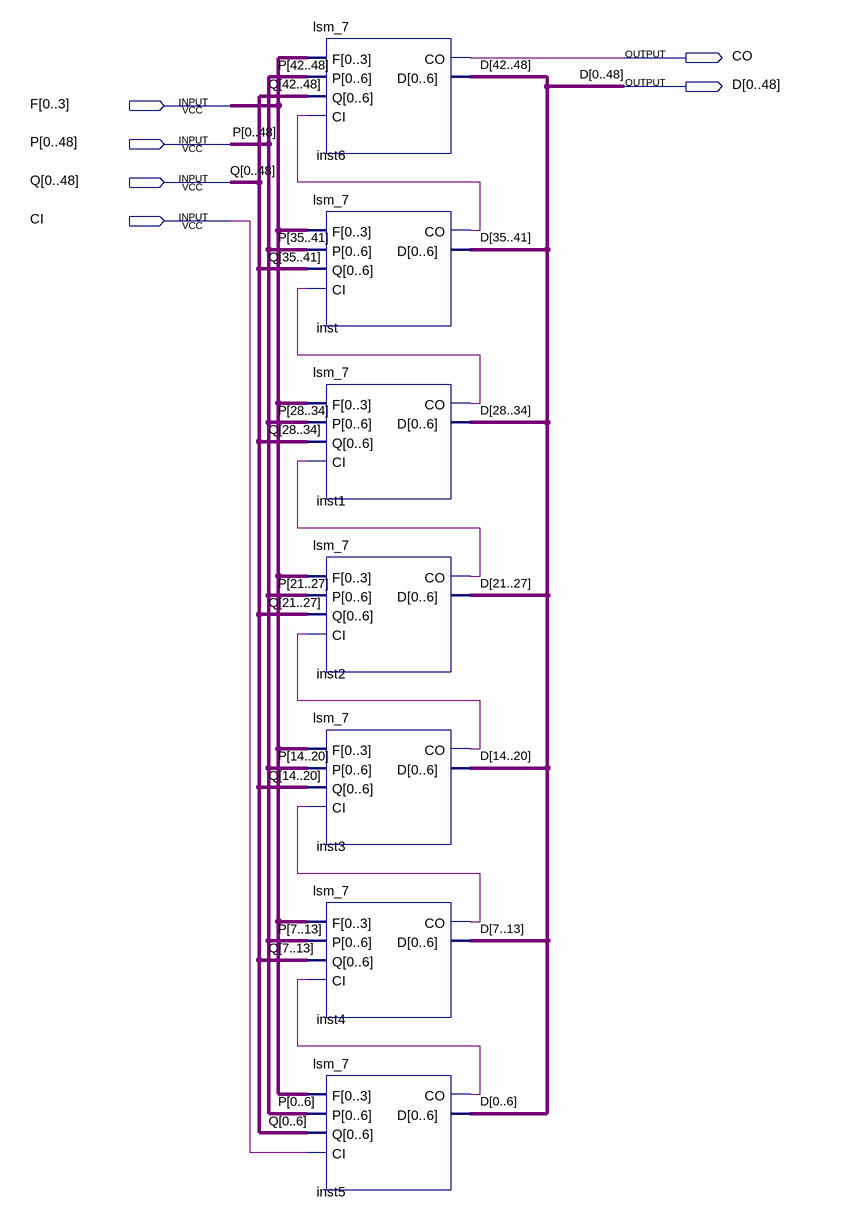
[diagram p0: schematic sheet]
// Quartus schematic lsm.bdf as structural Verilog: 7 symbols, 6 pins
module lsm (
  input  [0:3] F,
  input  [0:48] P,
  input  [0:48] Q,
  input  CI,
  output CO,
  output [0:48] D
);

  wire inst1_co, inst2_co, inst3_co, inst4_co, inst5_co, inst_co;

  lsm_7 inst6 (.F(F), .P(P[42:48]), .Q(Q[42:48]), .CI(inst_co), .CO(CO), .D(D[42:48]));
  lsm_7 inst (.F(F), .P(P[35:41]), .Q(Q[35:41]), .CI(inst1_co), .CO(inst_co), .D(D[35:41]));
  lsm_7 inst1 (.F(F), .P(P[28:34]), .Q(Q[28:34]), .CI(inst2_co), .CO(inst1_co), .D(D[28:34]));
  lsm_7 inst2 (.F(F), .P(P[21:27]), .Q(Q[21:27]), .CI(inst3_co), .CO(inst2_co), .D(D[21:27]));
  lsm_7 inst3 (.F(F), .P(P[14:20]), .Q(Q[14:20]), .CI(inst4_co), .CO(inst3_co), .D(D[14:20]));
  lsm_7 inst4 (.F(F), .P(P[7:13]), .Q(Q[7:13]), .CI(inst5_co), .CO(inst4_co), .D(D[7:13]));
  lsm_7 inst5 (.F(F), .P(P[0:6]), .Q(Q[0:6]), .CI(CI), .CO(inst5_co), .D(D[0:6]));
endmodule
